# EAGLE design macpi (EAGLE 9.6.2)
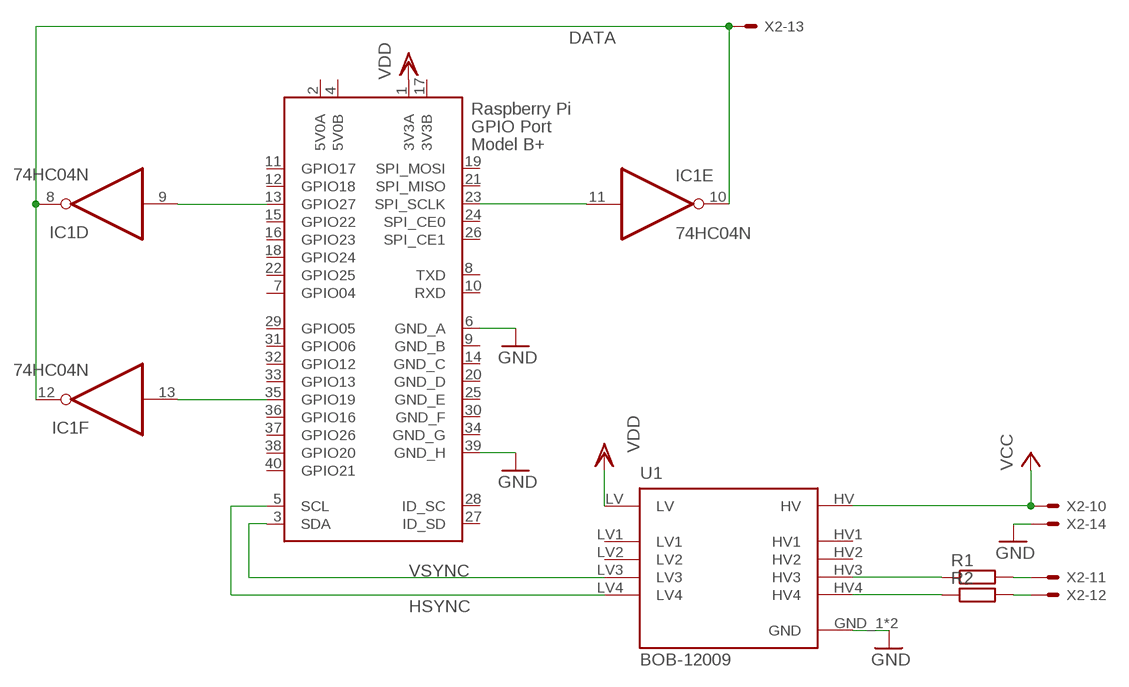
[diagram p0: schematic, sheet 1]

## Parts
IC1  74HC04N  [DIL14]
R1  R-EU_VMTA55  [VMTA55]
R2  R-EU_VMTA55  [VMTA55]
U1  BOB-12009  [CONV_BOB-12009]
X1  RASPI_GPIO_B+#_PIN  [RASPI_GPIO_B+_PIN]
X2  5566-14  [5566-14]

## Nets
DATA: IC1.8(D:O) IC1.10(E:O) IC1.12(F:O) X2.13
GND: U1.GND_1(GND) U1.GND_2(GND) X1.6(GND_A) X1.39(GND_H) X2.14
HSYNC: U1.LV4 X1.5(SCL)
N$1: IC1.11(E:I) X1.23(SPI_SCLK)
N$2: IC1.9(D:I) X1.13(GPIO27)
N$3: IC1.13(F:I) X1.35(GPIO19)
N$4: R2.1 U1.HV4
N$5: R1.2 X2.11
N$6: R1.1 U1.HV3
N$7: R2.2 X2.12
VCC: U1.HV X2.10
VDD: U1.LV X1.1(3V3A)
VSYNC: U1.LV3 X1.3(SDA)
Unconnected: IC1.1(A:I) IC1.2(A:O) IC1.3(B:I) IC1.4(B:O) IC1.5(C:I) IC1.6(C:O) U1.HV1 U1.HV2 U1.LV1 U1.LV2 X1.7(GPIO04) X1.8(TXD) X1.10(RXD) X1.11(GPIO17) X1.12(GPIO18) X1.15(GPIO22) X1.16(GPIO23) X1.18(GPIO24) X1.19(SPI_MOSI) X1.21(SPI_MISO) X1.22(GPIO25) X1.24(SPI_CE0) X1.26(SPI_CE1) X1.27(ID_SD) X1.28(ID_SC) X1.29(GPIO05) X1.31(GPIO06) X1.32(GPIO12) X1.33(GPIO13) X1.36(GPIO16) X1.37(GPIO26) X1.38(GPIO20) X1.40(GPIO21) X2.1 X2.2 X2.3 X2.4 X2.5 X2.6 X2.7 X2.8 X2.9

## Power pins joined to a net without a drawn wire
3V3B: X1.17(3V3B)
5V0A: X1.2(5V0A)
5V0B: X1.4(5V0B)
GND: IC1.7(P:GND)
GND_B: X1.9(GND_B)
GND_C: X1.14(GND_C)
GND_D: X1.20(GND_D)
GND_E: X1.25(GND_E)
GND_F: X1.30(GND_F)
GND_G: X1.34(GND_G)
VCC: IC1.14(P:VCC)

## Library data of the parts
IC1 = 74xx-eu:74*04: Hex INVERTER
R1 R2 = rcl:R-EU_: RESISTOR, European symbol; SPICEPREFIX: R
U1 = BOB-12009:BOB-12009: Logic Level Converter - Bi-Direc Check availability <https://pricing.snapeda.com/parts/BOB-12009/SparkFun/view-part?ref=eda>; AVAILABILITY: In Stock; CHECK_PRICES: https://www.snapeda.com/parts/BOB-12009/SparkFun+Electronics/view-part/?ref=eda; DESCRIPTION: BSS138 Logic-Level Translator Interface Evaluation Board; MF: SparkFun; MP: BOB-12009; PACKAGE: None; PRICE: None; PURCHASE-URL: https://www.snapeda.com/api/url_track_click_mouser/?unipart_id=551764&manufacturer=SparkFun&part_name=BOB-12009&search_term=None; SNAPEDA_LINK: https://www.snapeda.com/parts/BOB-12009/SparkFun+Electronics/view-part/?ref=snap
X1 = raspberrypi_bastelstube_v13:RASPI_GPIO_B+#: 2x20 header connector, all pins connected
X2 = con-molex:5566-14: Mini FIT connector 14 pol Source: http://www.molex.com; MF: MOLEX; OC_FARNELL: unknown; OC_NEWARK: unknown

## Board
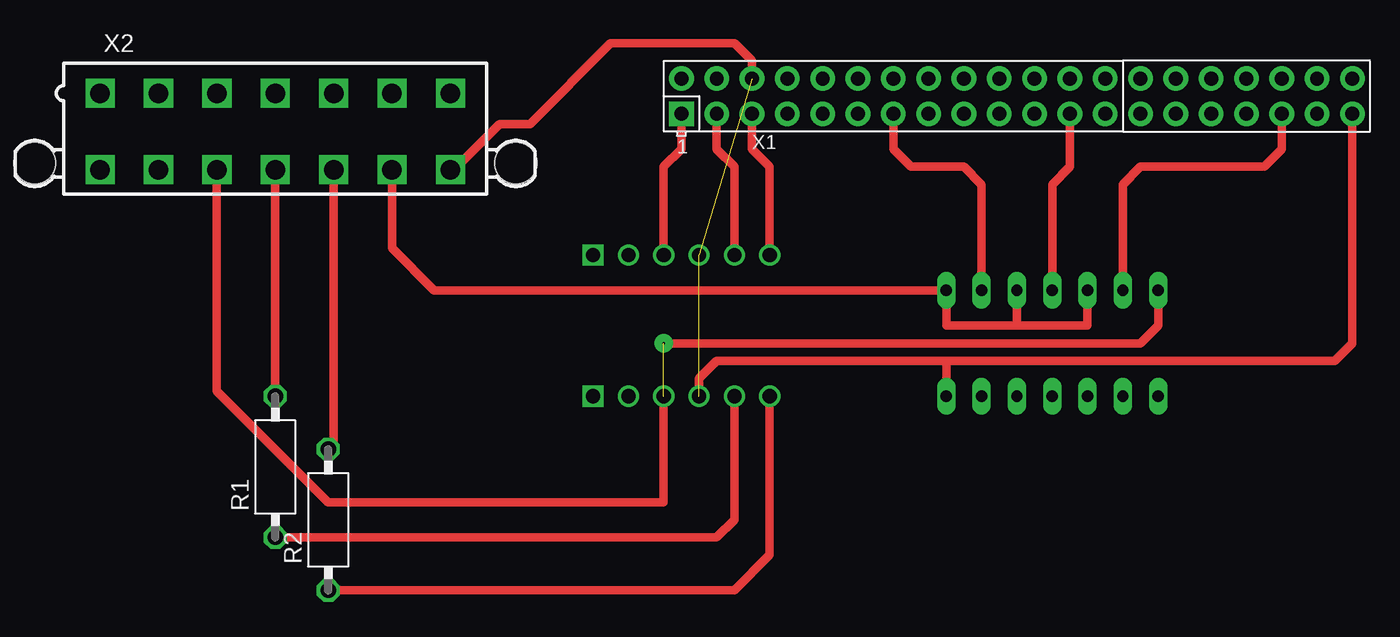
[diagram p1: board, top side]
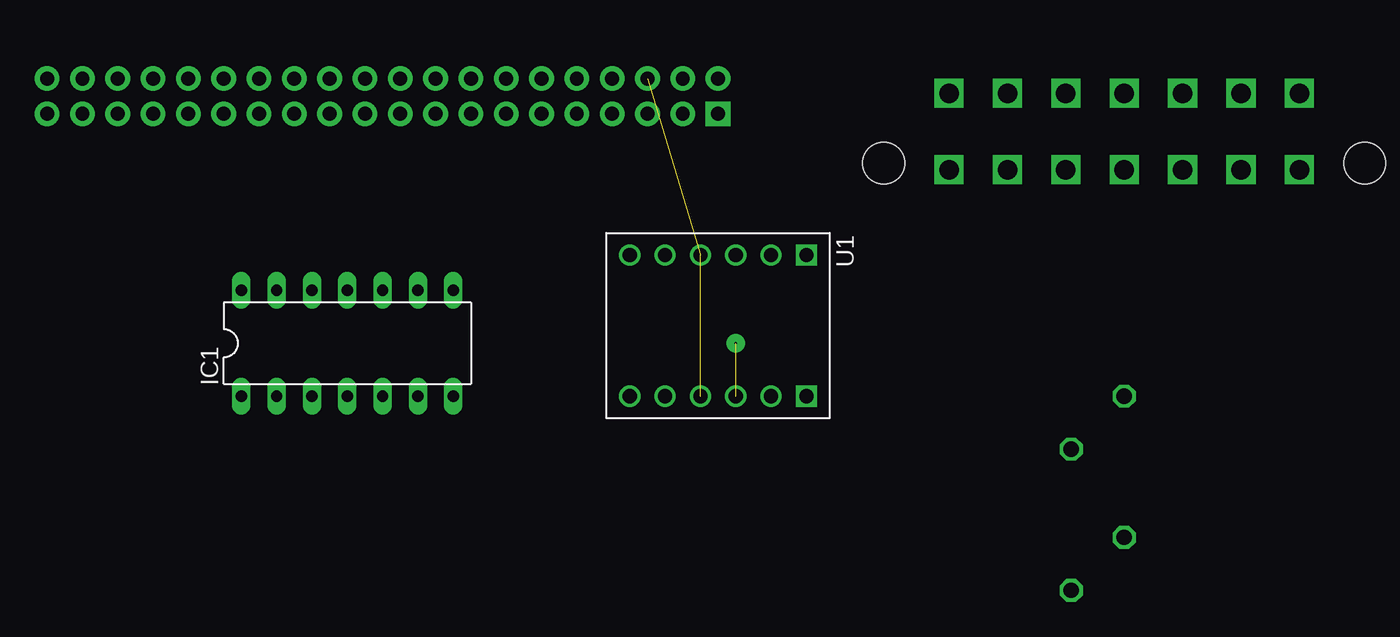
[diagram p2: board, bottom side, seen from below]

No outline drawn. Coordinates in mm, seen from the top.
Copper layers (1*16): Top 0.035mm / dielectric 1.5mm / Bottom 0.035mm
Design rules "default": minimum track width 6mil, minimum drill 0.35mm, track to track 6mil, track to pad 6mil, pad to pad 6mil, via to via 6mil, smd to smd 6mil, copper to edge 40mil, drill to drill 6mil, minimum pad ring 10mil, minimum via ring 8mil, stop-mask expansion 4mil, vias tented up to drill 0mil, thermal gap 10mil

### Footprints (pad centres in the part's own frame; a part is rotated, then mirrored left to right if it is on the bottom)
DIL14 = drill 0.813 long: 1 -7.62,-3.81; 2 -5.08,-3.81; 3 -2.54,-3.81; 4 0,-3.81; 5 2.54,-3.81; 6 5.08,-3.81; 7 7.62,-3.81; 8 7.62,3.81; 9 5.08,3.81; 10 2.54,3.81; 11 0,3.81; 12 -2.54,3.81; 13 -5.08,3.81; 14 -7.62,3.81
VMTA55 = drill 1.1 octagon: 1 -5.08,0; 2 5.08,0
CONV_BOB-12009 = drill 1.016: GND_1 5.08,-1.27; GND_2 -5.08,-1.27; HV 5.08,1.27; HV2 5.08,3.81; HV3 5.08,-3.81; HV4 5.08,-6.35; LV -5.08,1.27; LV2 -5.08,3.81; LV3 -5.08,-3.81; LV4 -5.08,-6.35 | drill 1.016 square: HV1 5.08,6.35; LV1 -5.08,6.35
RASPI_GPIO_B+_PIN = drill 1 pad 1.778 square: 1 -24.13,-1.27 | drill 1 pad 1.778: 2 -24.13,1.27; 3 -21.59,-1.27; 4 -21.59,1.27; 5 -19.05,-1.27; 6 -19.05,1.27; 7 -16.51,-1.27; 8 -16.51,1.27; 9 -13.97,-1.27; 10 -13.97,1.27; 11 -11.43,-1.27; 12 -11.43,1.27; 13 -8.89,-1.27; 14 -8.89,1.27; 15 -6.35,-1.27; 16 -6.35,1.27; 17 -3.81,-1.27; 18 -3.81,1.27; 19 -1.27,-1.27; 20 -1.27,1.27; 21 1.27,-1.27; 22 1.27,1.27; 23 3.81,-1.27; 24 3.81,1.27; 25 6.35,-1.27; 26 6.35,1.27; 27 8.89,-1.27; 28 8.89,1.27; 29 11.43,-1.27; 30 11.43,1.27; 31 13.97,-1.27; 32 13.97,1.27; 33 16.51,-1.27; 34 16.51,1.27; 35 19.05,-1.27; 36 19.05,1.27; 37 21.59,-1.27; 38 21.59,1.27; 39 24.13,-1.27; 40 24.13,1.27
5566-14 = drill 1.4 square: 1 12.6,-2.75; 2 8.4,-2.75; 3 4.2,-2.75; 4 0,-2.75; 5 -4.2,-2.75; 6 -8.4,-2.75; 7 -12.6,-2.75; 8 12.6,2.75; 9 8.4,2.75; 10 4.2,2.75; 11 0,2.75; 12 -4.2,2.75; 13 -8.4,2.75; 14 -12.6,2.75 | hole 3: 17.3,2.29; -17.3,2.29

### Placement (x,y rotation side)
IC1  76.2,21.59 0 bottom
R1  20.32,12.7 90 top
R2  24.13,8.89 90 top
U1  49.53,22.86 270 bottom
X1  73.66,39.37 0 top
X2  20.32,36.83 180 top

### Tracks (layer width: path | path; a pad name or v marks a point on that pad's centre or on a via)
DATA
  Top 0.61: 73.66,22.86 68.58,22.86 IC1.8 31.75,25.4 28.72,28.43 X2.13 | 73.66,22.86 78.74,22.86 IC1.12 | IC1.10 73.66,22.86
GND  (2 unrouted)
  Top 0.61: U1.GND_1 50.8,19.05 52.07,20.32 68.58,20.32 | 68.58,20.32 IC1.7 | X1.39 97.79,21.59 96.52,20.32 68.58,20.32 | X1.6 54.61,41.91 53.34,43.18 44.45,43.18 38.63,37.36 36.45,37.36 33.17,34.08 X2.14
HSYNC
  Top 0.61: U1.LV4 55.88,34.29 54.61,35.56 X1.5
N$1
  Top 0.61: IC1.11 76.2,33.02 77.47,34.29 X1.23
N$2
  Top 0.61: IC1.9 71.12,33.02 69.85,34.29 66.04,34.29 64.77,35.56 X1.13
N$3
  Top 0.61: IC1.13 81.28,33.02 82.55,34.29 91.44,34.29 92.71,35.56 X1.35
N$4
  Top 0.61: R2.1 53.34,3.81 55.88,6.35 U1.HV4
N$5
  Top 0.61: X2.11 R1.2
N$6
  Top 0.61: R1.1 52.07,7.62 53.34,8.89 U1.HV3
N$7
  Top 0.61: X2.12 24.52,14.36 R2.2
N$8  (via drill 0.2 pad 1.3)
  other vias: 48.26,21.59
VCC  (1 unrouted)
  Top 0.61: IC1.14 83.82,22.86 82.55,21.59 48.26,21.59 | X2.10 16.12,18.17 24.13,10.16 48.26,10.16 U1.HV
VDD
  Top 0.61: U1.LV 48.26,34.29 49.53,35.56 X1.1
VSYNC
  Top 0.61: U1.LV3 53.34,34.29 52.07,35.56 X1.3